# EasyEDA Pro project ProPrj_PCB_2025-05-19.epro, board 手指0.2
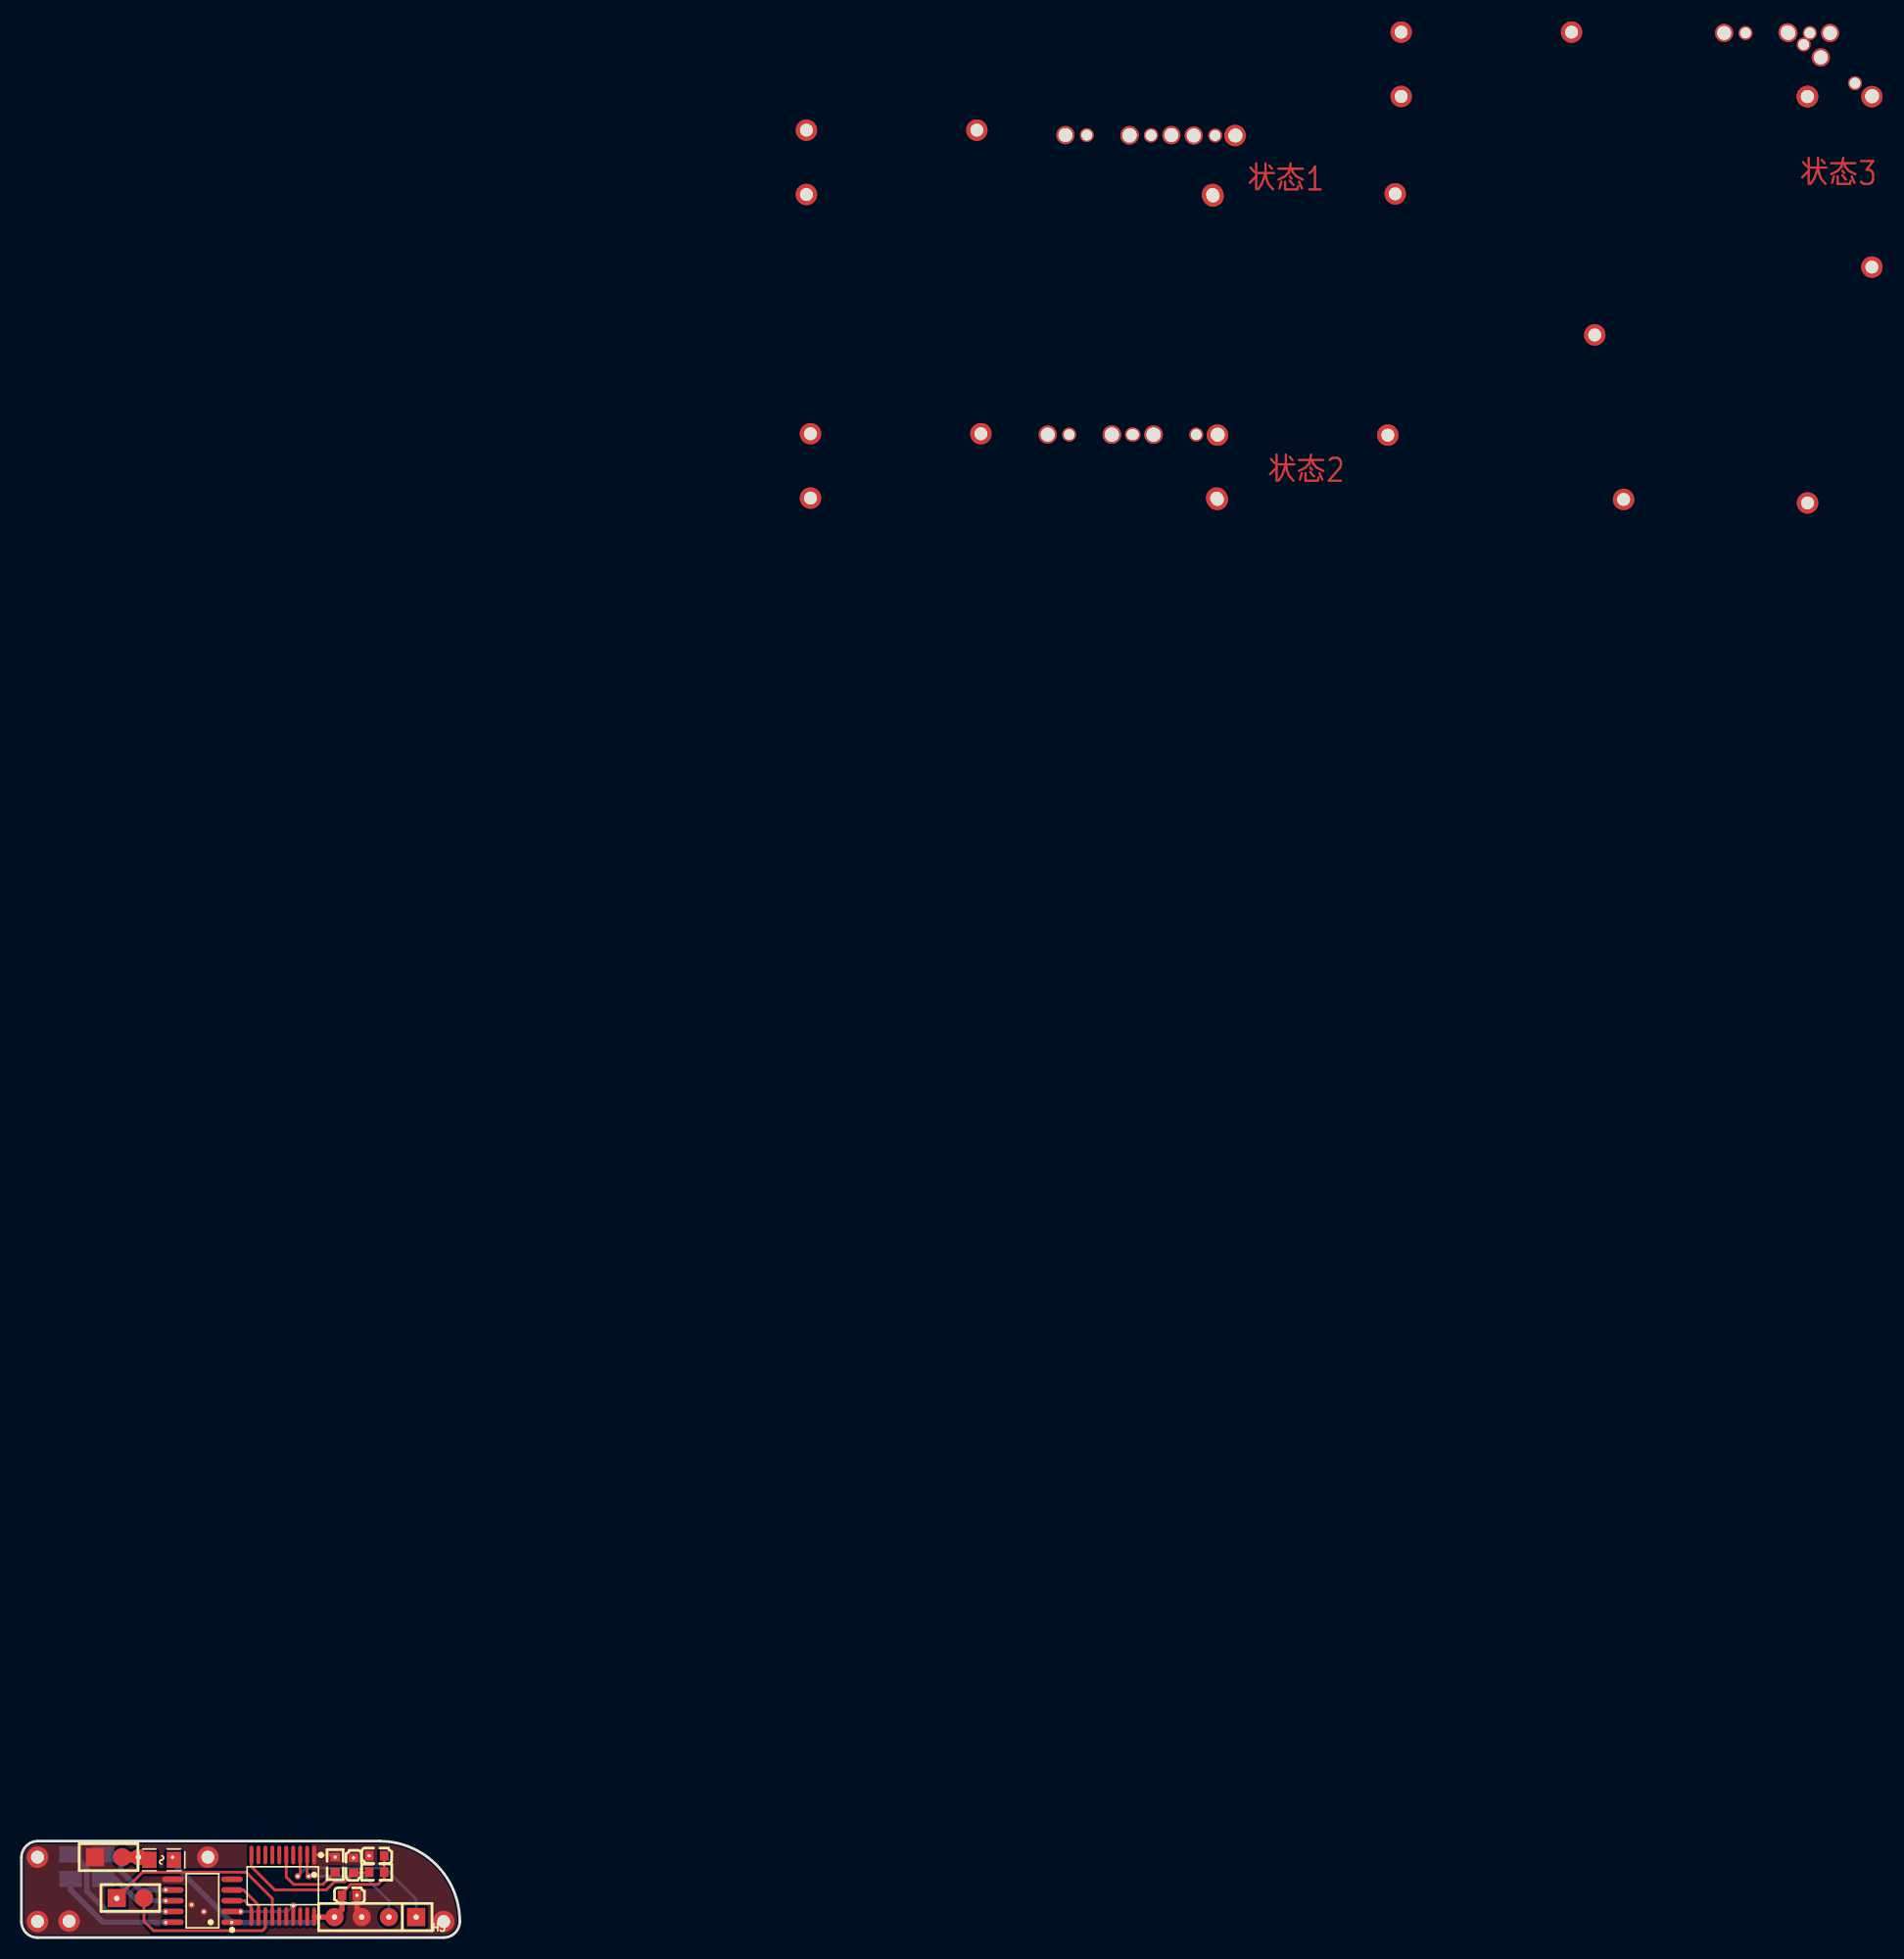
[diagram p14: board, top side]
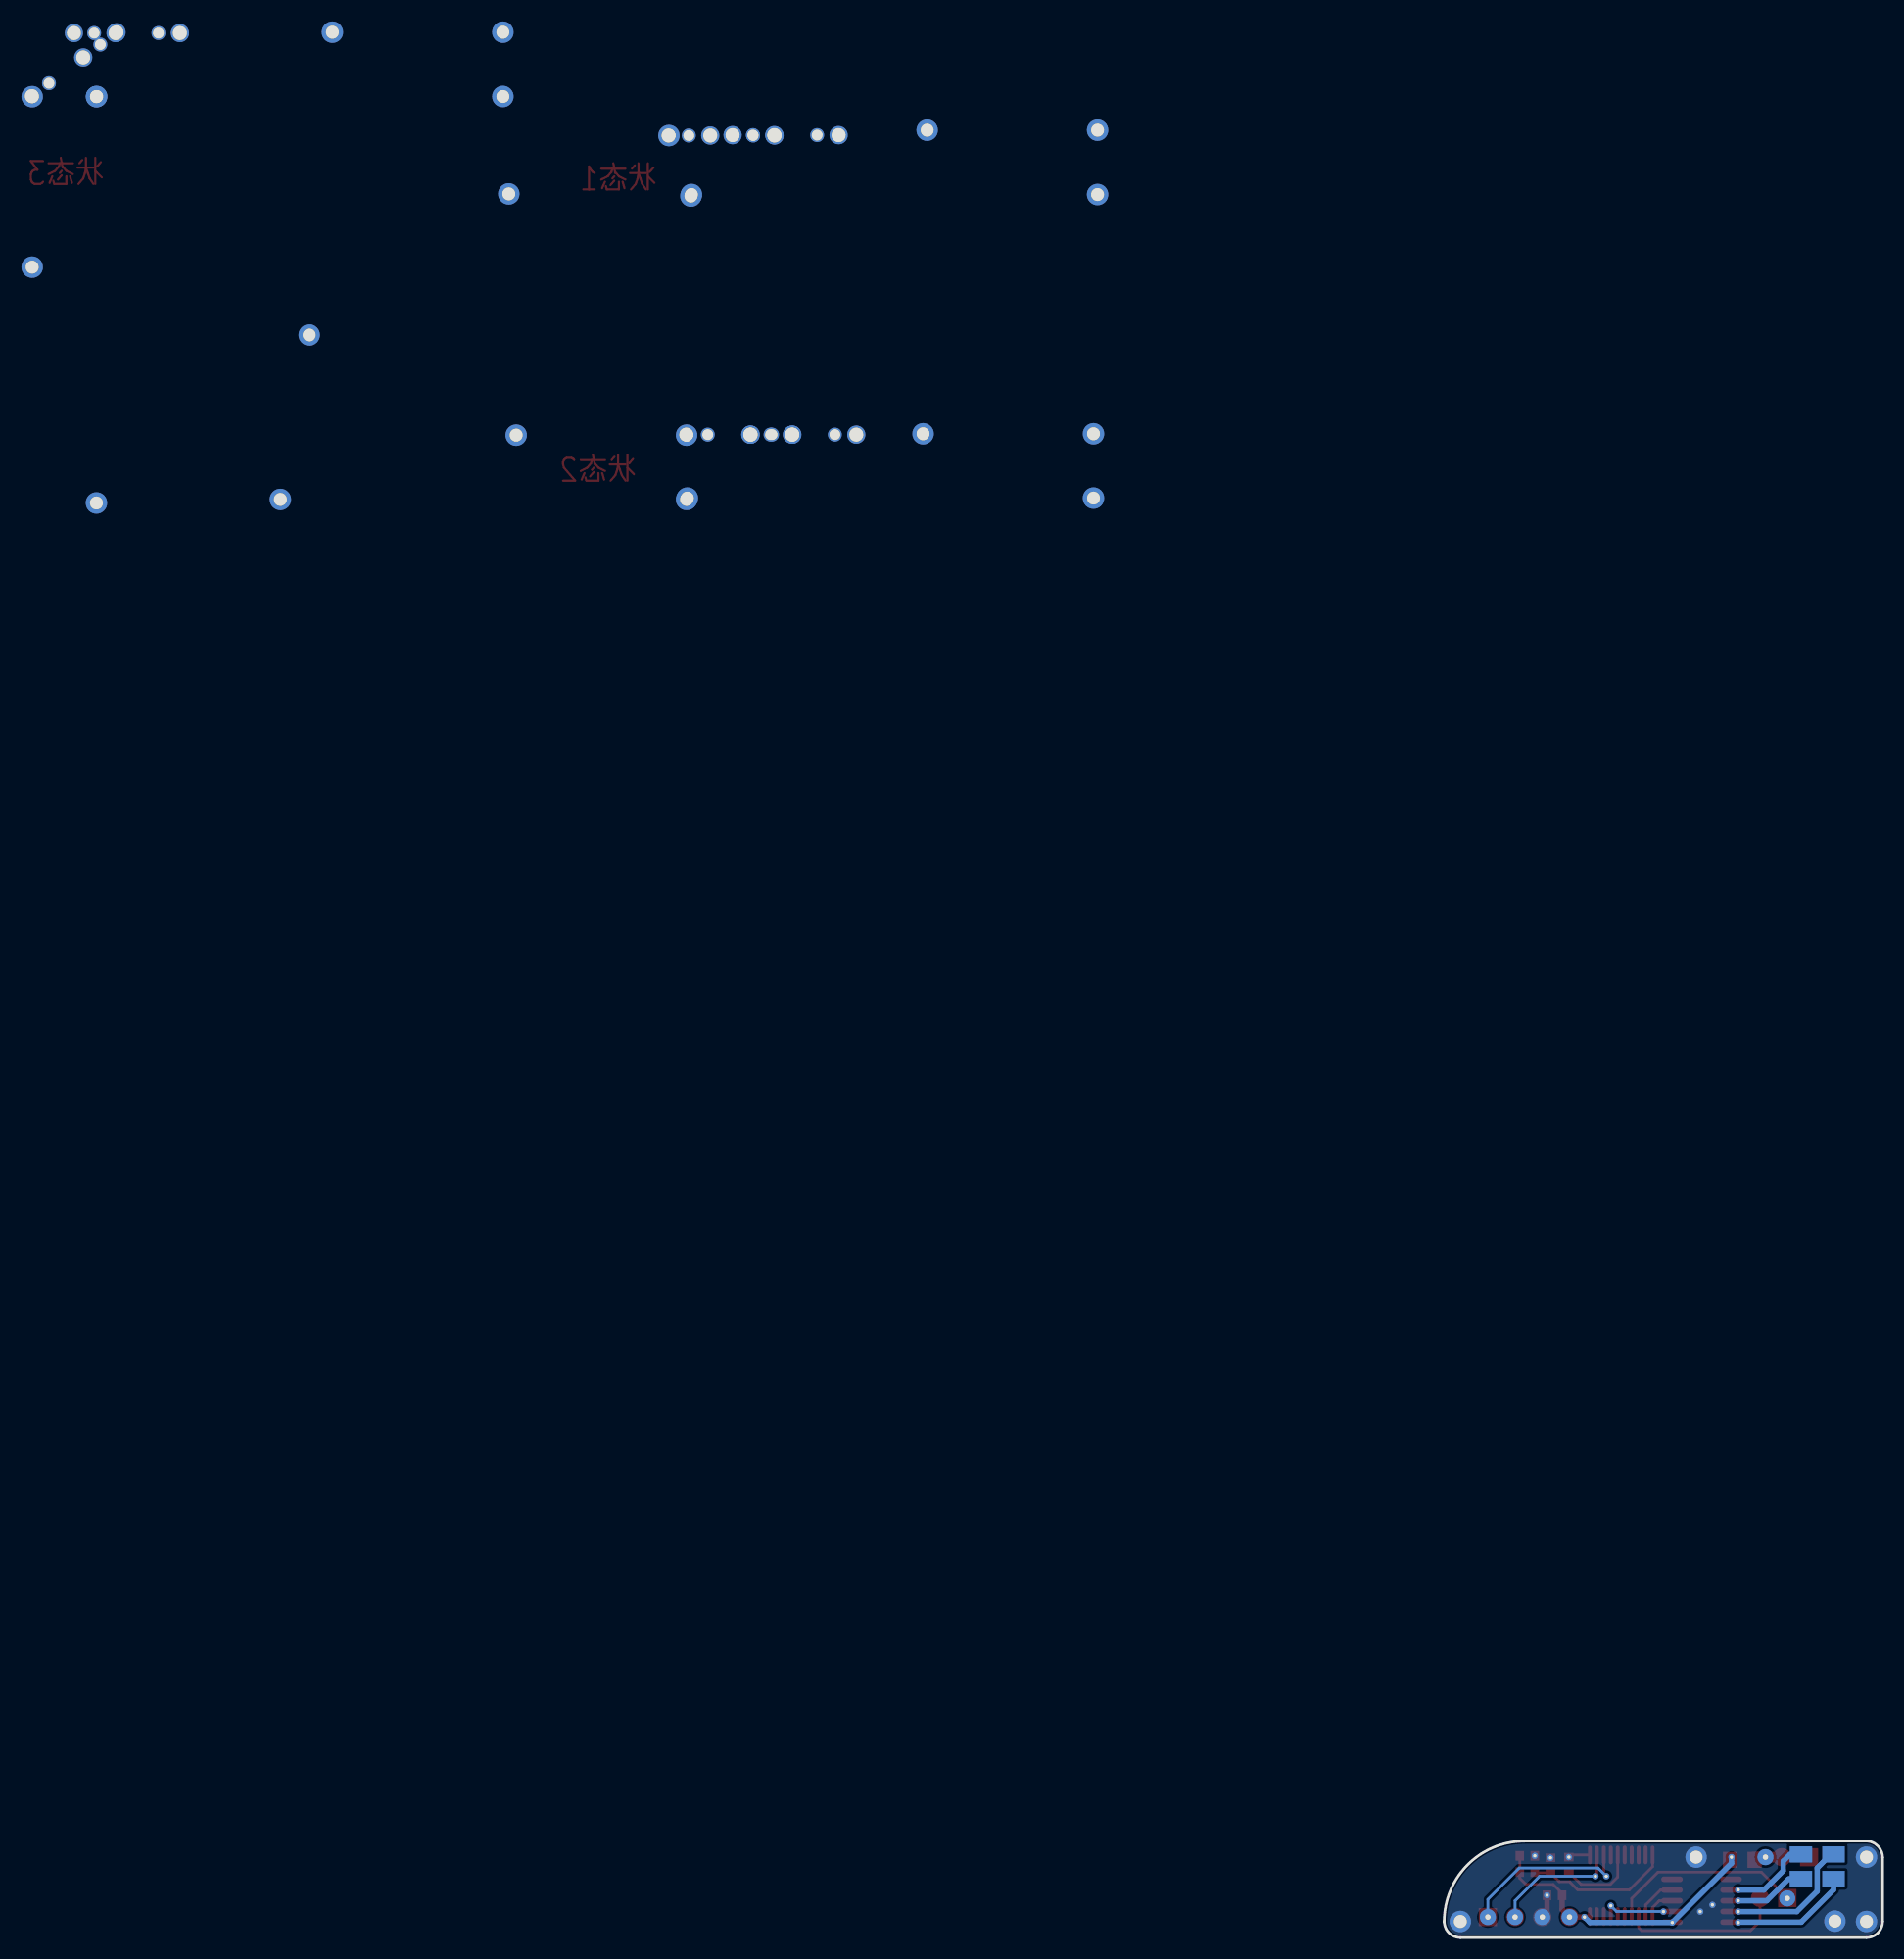
[diagram p15: board, bottom side, seen from below]

Outline 40.91 x 9 mm; copper layers: Top Layer, Bottom Layer. Coordinates in mm from the lower left corner of the outline.
Outline path: 0,7.47 arc(0.44,8.54) 1.5,9 33.4,9 33.4,8.99 arc(38.71,6.8) 40.91,1.49 40.9,1.5 arc(40.46,0.44) 39.4,0 1.5,0 arc(0.44,0.44) 0,1.5 0,7.47
Stack: Top Layer 0.035mm / Dielectric1 1.51mm FR4 er 4.5 / Bottom Layer 0.035mm

## Design rules (mm)
template: 自定义配置
spacing copperThickness1oz (default): track to track 0.102, other pairs 0.152 to 0.3
spacing copperThickness2oz: track to track 0.203, other pairs 0.152 to 0.3
track width copperThickness1oz (default): min 0.127, default 0.254, max 2.54
track width copperThickness2oz: min 0.203, default 0.254, max 2.54
differential pair differentialPair (default): width min 0.127, default 0.254, max 2.54; gap min 0.152, default 0.152
via viaSize (default): diameter min 0.5, default 0.61, max 10; hole min 0.3, default 0.305, max 6.3

## Placement (name value [footprint] x y rotation side)
C28  10uF  [C0603]  30.99 6.74 270 top
C32  10uF  [C0603]  33.15 7.63 0 top
C33  10uF  [C0603]  30.61 3.94 180 top
H3  -  [HDR-TH_4P-P2.54-V-F]  33.02 1.91 180 top
H4  -  [HDR-TH_2P-P2.54-V-F]  8.13 7.5 0 top
H5  -  [HDR-TH_2P-P2.54-V-F#2]  10.16 3.69 180 top
NOREF  -  [Pad_e951]  25.78 5.72 0 top
NOREF#2  -  [Pad_e1]  4.45 1.53 0 top
NOREF#3  -  [Pad_e75]  7.62 5.47 0 top
NOREF#4  -  [Pad_e74]  4.58 5.47 0 top
NOREF#5  -  [Pad_e83]  29.21 1.91 0 top
NOREF#6  -  [Pad_e333]  13.47 3.44 0 top
NOREF#7  -  [Pad_e73]  7.62 7.75 0 top
NOREF#8  -  [Pad_e22]  1.5 7.5 0 top
NOREF#9  -  [Pad_e7]  39.4 1.5 0 top
NOREF#10  -  [Pad_e331]  13.47 1.4 0 top
NOREF#11  -  [Pad_e322]  20.45 2.42 0 top
NOREF#12  -  [Pad_e334]  13.47 4.45 0 top
NOREF#13  -  [Pad_e901]  27.82 1.91 0 top
NOREF#14  -  [Pad_e311]  29.28 7.5 0 top
NOREF#15  -  [Pad_e416]  8.89 3.66 0 top
NOREF#16  -  [Pad_e135]  19.63 1.4 0 top
NOREF#17  -  [Pad_e294]  10.93 7.5 0 top
NOREF#18  -  [Pad_e71]  4.58 7.75 0 top
NOREF#19  -  [Pad_e313]  32.45 7.63 0 top
NOREF#20  -  [Pad_e0]  17.4 7.5 0 top
NOREF#21  -  [Pad_e114]  17.02 2.42 0 top
NOREF#22  -  [Pad_e909]  25.36 2.97 0 top
NOREF#23  -  [Pad_e312]  30.99 7.44 0 top
NOREF#24  -  [Pad_e21]  1.5 1.5 0 top
NOREF#25  -  [Pad_e332]  13.47 2.42 0 top
NOREF#26  -  [Pad_e65]  36.83 1.91 0 top
NOREF#27  -  [Pad_e952]  26.8 5.72 0 top
NOREF#28  -  [Pad_e97]  14.1 7.5 0 top
NOREF#29  -  [Pad_e62]  34.29 1.91 0 top
NOREF#30  -  [Pad_e478]  15.88 3.06 0 top
NOREF#31  -  [Pad_e314]  31.31 3.94 0 top
NOREF#32  -  [Pad_e60]  31.75 1.91 0 top
R14  10K  [R0603]  29.28 6.8 90 top
R57  10K  [R0603]  33.15 6.1 0 top
U2  AT8549  [SSOP-10_L4.9-W3.9-P1.00-LS6.0-BL]  16.9 3.44 90 top
U6  PY32F002A  [TSSOP-20_L6.5-W4.4-P0.65-LS6.4-BL]  24.39 4.83 180 top
U7  BSMD0805-050-12V  [F0805]  13.09 7.25 0 top
U8  -  [手指杆组]  101.72 168.32 0 top
U8#2  -  [手指杆组]  107.7 168.28 0 top
U8#3  -  [手指杆组]  100.07 140.38 0 top
U8#4  -  [手指杆组]  107.33 140.05 180 top
U8#5  -  [手指杆组]  169.17 174.25 143 top
U8#6  -  [手指杆组]  163.19 177.84 0 top
U9  -  [关节手指]  128.4 159.14 340 top
U9#2  -  [关节手指]  146.05 174.5 0 top
U9#3  -  [关节手指]  90.56 165.36 0 top
U9#4  -  [关节手指]  90.94 137.04 0 top
U9#5  -  [关节手指]  128.91 136.91 0 top
U9#6  -  [关节手指]  169.42 154.44 270 top

## Footprints (pads in the part's own frame, mm; a bottom-side part is the same pattern mirrored in y, then rotated)
C0603
  rect 0.8x0.9 smd: 1(-0.7,0) 2(0.7,0)
F0805
  rect 1.335x1.5 smd: 1(-1.143,0) 2(1.143,0)
HDR-TH_2P-P2.54-V-F
  rect 1.7x1.7 smd: 1(-1.27,0)
  round 1.7 smd: 2(1.27,0)
HDR-TH_2P-P2.54-V-F#2
  round 1.7 smd: 1(-1.27,0)
  rect 1.7x1.7 smd: 2(1.27,0)
HDR-TH_4P-P2.54-V-F
  rect 1.7x1.7 smd: 1(-3.81,0)
  round 1.7 smd: 2(-1.27,0) 3(1.27,0) 4(3.81,0)
Pad_e0
  round 2 hole 1.2: 1(0,0)
Pad_e1
  round 2 hole 1.2: 1(0,0)
Pad_e7
  round 2 hole 1.2: 1(0,0)
Pad_e21
  round 2 hole 1.2: 1(0,0)
Pad_e22
  round 2 hole 1.2: 1(0,0)
Pad_e60
  round 1.5 hole 0.5: 1(0,0)
Pad_e62
  round 1.5 hole 0.5: 1(0,0)
Pad_e65
  round 1.5 hole 0.5: 1(0,0)
Pad_e71
  rect 2.1x1.5 smd far side: 1(0,0)
Pad_e73
  rect 2.1x1.5 smd far side: 1(0,0)
Pad_e74
  rect 2.1x1.5 smd far side: 1(0,0)
Pad_e75
  rect 2.1x1.5 smd far side: 1(0,0)
Pad_e83
  round 1.5 hole 0.5: 1(0,0)
Pad_e97
  round 0.6 hole 0.3: 1(0,0)
Pad_e114
  round 0.6 hole 0.3: 1(0,0)
Pad_e135
  round 0.6 hole 0.3: 1(0,0)
Pad_e294
  round 1.5 hole 0.5: 1(0,0)
Pad_e311
  round 0.6 hole 0.3: 1(0,0)
Pad_e312
  round 0.6 hole 0.3: 1(0,0)
Pad_e313
  round 0.6 hole 0.3: 1(0,0)
Pad_e314
  round 0.6 hole 0.3: 1(0,0)
Pad_e322
  round 0.6 hole 0.3: 1(0,0)
Pad_e331
  round 0.6 hole 0.3: 1(0,0)
Pad_e332
  round 0.6 hole 0.3: 1(0,0)
Pad_e333
  round 0.6 hole 0.3: 1(0,0)
Pad_e334
  round 0.6 hole 0.3: 1(0,0)
Pad_e416
  round 1.5 hole 0.5: 1(0,0)
Pad_e478
  round 0.6 hole 0.3: 1(0,0)
Pad_e901
  round 0.6 hole 0.3: 1(0,0)
Pad_e909
  round 0.6 hole 0.3: 1(0,0)
Pad_e951
  round 0.6 hole 0.3: 1(0,0)
Pad_e952
  round 0.6 hole 0.3: 1(0,0)
R0603
  rect 0.8x0.9 smd: 1(-0.7,0) 2(0.7,0)
SSOP-10_L4.9-W3.9-P1.00-LS6.0-BL
  oval 0.525x2.014 smd: 1(-2,-2.756) 2(-1,-2.756) 3(0,-2.756) 4(1,-2.756) 5(2,-2.756) 6(2,2.756) 7(1,2.756) 8(0,2.756) 9(-1,2.756) 10(-2,2.756)
TSSOP-20_L6.5-W4.4-P0.65-LS6.4-BL
  oval 0.364x1.742 smd: 1(-2.925,-2.871) 2(-2.275,-2.871) 3(-1.625,-2.871) 4(-0.975,-2.871) 5(-0.325,-2.871) 6(0.325,-2.871) 7(0.975,-2.871) 8(1.625,-2.871) 9(2.275,-2.871) 10(2.925,-2.871) 11(2.925,2.871) 12(2.275,2.871) 13(1.625,2.871) 14(0.975,2.871) 15(0.325,2.871) 16(-0.325,2.871) 17(-0.975,2.871) 18(-1.625,2.871) 19(-2.275,2.871) 20(-2.925,2.871)
关节手指
  round 2 hole 1.2: 1(-17.303,3.254) 1(-17.303,-2.746) 1(-1.4,3.254) 1(20.6,-2.746)
手指杆组
  round 1.7 hole 1.3: 1(-4.302,-0.164) 1(1.698,-0.164) 1(5.588,-0.164)
  round 1.3 hole 1: 1(-2.302,-0.164) 1(3.698,-0.164)

## Nets
GND: C28.1 C32.1 C33.1 H3.3 H4.1 NOREF#2.1 NOREF#8.1 NOREF#9.1 NOREF#14.1 NOREF#19.1 NOREF#20.1 NOREF#21.1 NOREF#23.1 NOREF#24.1 NOREF#30.1 NOREF#31.1 NOREF#32.1 R14.2 U2.6 U6.1
A+: NOREF#4.1 NOREF#10.1 U2.10
A-: NOREF#18.1 NOREF#25.1 U2.9
B+: NOREF#3.1 NOREF#6.1 U2.8
B-: NOREF#7.1 NOREF#12.1 U2.7
PY32F002A_VCC: C32.2 C33.2 H3.4 NOREF#5.1 NOREF#13.1 NOREF#16.1 NOREF#28.1 R57.2 U2.1 U6.20 U7.2
PY_NRST: C28.2 R57.1 U6.10
PY_PA0: U2.3 U6.11
PY_PA1: U2.4 U6.12
PY_PA2: H5.1 U6.13
PY_PA3: H5.2 NOREF#15.1 U6.14
PY_PA4: U6.15
PY_PA5: U6.7
PY_PA6: U6.6
PY_PA7: U6.16
PY_PA13: H3.2 NOREF#27.1 NOREF#29.1 U6.2
PY_PA14: H3.1 NOREF.1 NOREF#26.1 U6.3
PY_PB0: NOREF#11.1 NOREF#22.1 U2.2 U6.17
PY_PB1: U6.19
PY_PB2: U6.18
PY_PB3: U6.4
PY_PB6: R14.1 U6.5
PY_PF0: U6.8
PY_PF1: U6.9
$1N4187: H4.2 NOREF#17.1 U7.1

Pads without a net: U2 5; U8 1; U8#2 1; U8#3 1; U8#4 1; U8#5 1; U8#6 1; U9 1; U9#2 1; U9#3 1; U9#4 1; U9#5 1; U9#6 1

## Routing (per net, layer and track width the routed paths; a pad name or vN(x,y) marks a point on that pad's centre or on a via; arc(x,y) is an arc through that point)
GND: length 4.4
  Top Layer w0.254: U6.1 29.01,7.7 29.39,7.33
  Top Layer w0.5: C33.1 31.31,2.36 NOREF#32.1
A+: length 11.2
  Bottom Layer w0.5: NOREF#10.1 13.43,1.44 7.59,1.44 4.58,4.45 NOREF#4.1
A-: length 12.4
  Bottom Layer w0.5: NOREF#18.1 4.83,7.75 6.1,6.48 6.1,4.33 8,2.42 NOREF#25.1
B+: length 6.7
  Bottom Layer w0.5: NOREF#3.1 8.77,5.47 10.8,3.44 NOREF#6.1
B-: length 7.7
  Bottom Layer w0.5: NOREF#12.1 13.45,4.44 11.07,4.44 9.28,6.23 9.28,7.12 8.64,7.75 NOREF#7.1
PY32F002A_VCC: length 27.8
  Top Layer w0.254: C32.2 R57.2 33.85,5.53 33.28,4.96 30.74,4.96 29.91,4.13 C33.2
  Top Layer w0.5: U6.20 27.36,1.91 NOREF#13.1 NOREF#5.1 29.91,2.61 C33.2
  Bottom Layer w0.5: NOREF#13.1 27.31,1.4 NOREF#16.1 14.1,6.93 NOREF#28.1
PY_NRST: length 13.7
  Top Layer w0.254: R57.1 32.39,6.04 C28.2 30.17,5.21 29.21,5.21 28.45,4.45 23.63,4.45 21.46,6.61 U6.10
PY_PA0: length 3.2
  Top Layer w0.254: U2.3 20.83,3.44 21.46,2.81 21.46,1.71
PY_PA1: length 4.6
  Top Layer w0.254: U2.4 20.72,4.44 22.11,3.04 22.11,1.45
PY_PA2: length 15.4
  Top Layer w0.254: U6.13 22.76,0.92 22.48,0.64 12.32,0.64 11.43,1.53 11.43,4.07
PY_PA3: length 18.6
  Top Layer w0.254: U6.14 23.41,3.65 20.96,6.1 11.31,6.1 H5.2 8.89,4.07
PY_PA13: length 11.5
  Top Layer w0.254: U6.2 26.66,5.86 NOREF#27.1
  Bottom Layer w0.254: NOREF#27.1 32.01,5.72 34.29,3.44 34.29,2.42
PY_PA14: length 16.3
  Top Layer w0.254: NOREF.1 26.01,5.95 U6.3
  Bottom Layer w0.254: NOREF.1 26.55,6.48 33.91,6.48 36.83,3.56 NOREF#26.1
PY_PB0: length 6.7
  Top Layer w0.254: 25.36,1.45 NOREF#22.1
  Bottom Layer w0.254: NOREF#22.1 24.83,2.44 20.47,2.44 NOREF#11.1
PY_PB2: length 1
  Top Layer w0.254: 26.01,2.48 26.01,1.45
PY_PB6: length 7.4
  Top Layer w0.254: R14.1 28.13,4.96 25.4,4.96 24.71,5.65 U6.5
$1N4187: length 2.7
  Top Layer w1: H4.2 NOREF#17.1 12.07,7.5

## Copper pours and planes (outline as drawn; the poured copper is in the pictures)
GND on Top Layer: -0.76,10.17 42.42,10.17 42.42,-1.77 -0.76,-1.77
GND on Bottom Layer: -0.5,10.17 41.66,10.17 41.66,-2.15 -0.5,-2.15

## Text on the board
Top Layer: 状态1 | 状态2 | 状态3
